# EAGLE design SignalSelector (EAGLE 8.7.0)
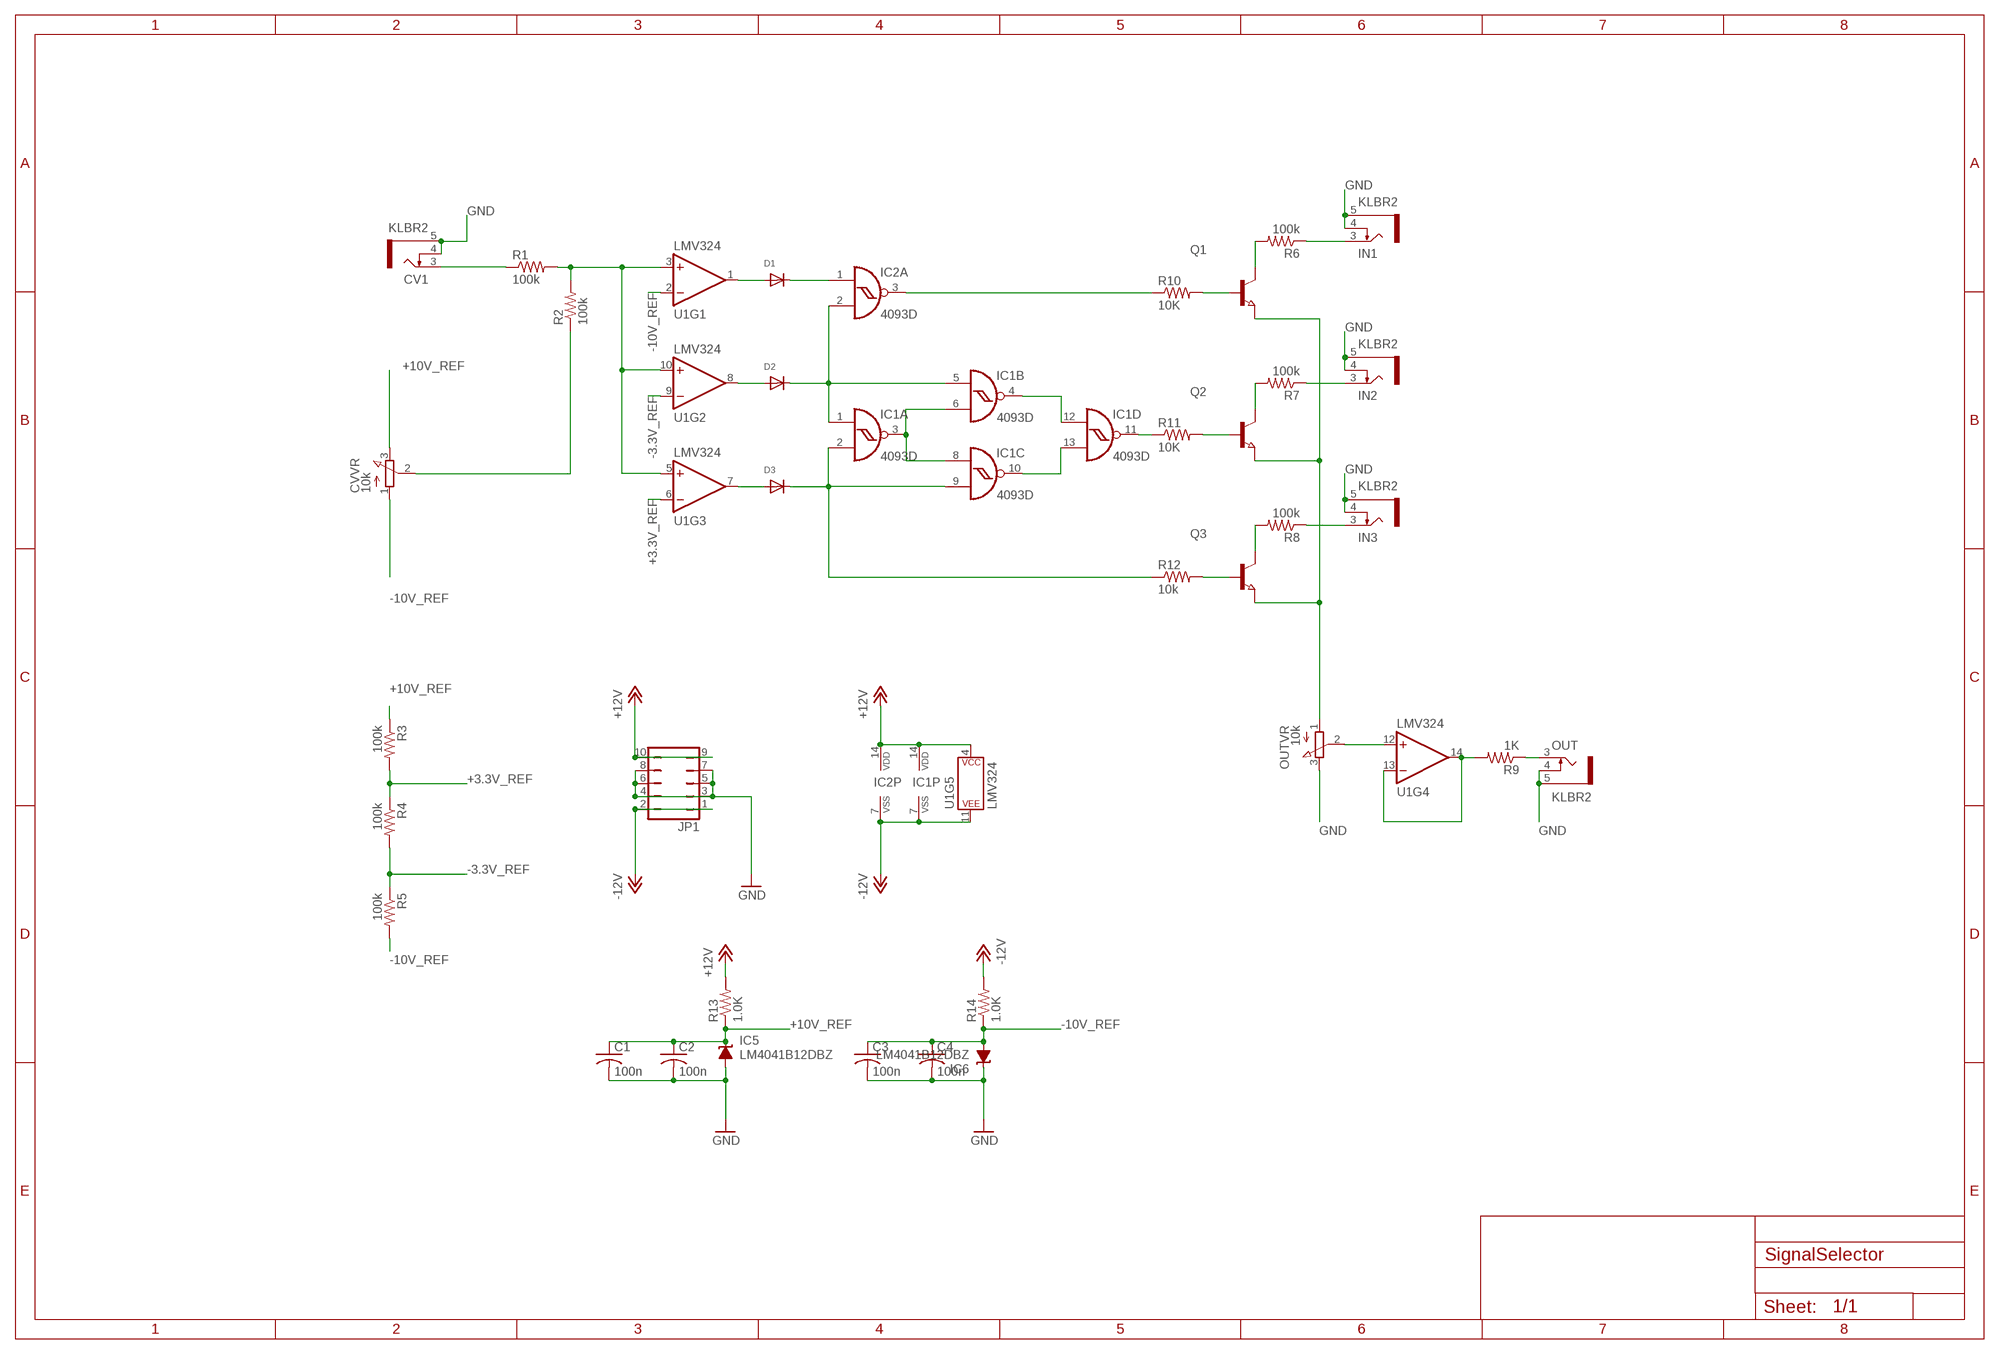
[diagram p0: schematic, sheet 1]

## Parts
C1  100n  C-USC0603  [C0603]
C2  100n  C-USC0603  [C0603]
C3  100n  C-USC0603  [C0603]
C4  100n  C-USC0603  [C0603]
CV1  KLBR2  [KLBR2]
CVVR  10k  3RP/1610N  [3RP/1610N]
D1  DIODE_SOD-123FL  [SOD-123FL]
D2  DIODE_SOD-123FL  [SOD-123FL]
D3  DIODE_SOD-123FL  [SOD-123FL]
IC1  4093D  [SO14]
IC2  4093D  [SO14]
IC5  LM4041B12DBZ  [DBZ_R-PDSO-G3]
IC6  LM4041B12DBZ  [DBZ_R-PDSO-G3]
IN1  KLBR2  [KLBR2]
IN2  KLBR2  [KLBR2]
IN3  KLBR2  [KLBR2]
JP1  JP5Q  [JP5Q]
OUT  KLBR2  [KLBR2]
OUTVR  10k  3RP/1610N  [3RP/1610N]
Q1  NPN-TRANSISTOR_SOT23  [SOT23]
Q2  NPN-TRANSISTOR_SOT23  [SOT23]
Q3  NPN-TRANSISTOR_SOT23  [SOT23]
R1  100k  R-US_R0603  [R0603]
R2  100k  R-US_R0603  [R0603]
R3  100k  R-US_R0603  [R0603]
R4  100k  R-US_R0603  [R0603]
R5  100k  R-US_R0603  [R0603]
R6  100k  R-US_R0603  [R0603]
R7  100k  R-US_R0603  [R0603]
R8  100k  R-US_R0603  [R0603]
R9  1K  R-US_R0603  [R0603]
R10  10K  R-US_R0603  [R0603]
R11  10K  R-US_R0603  [R0603]
R12  10k  R-US_R0603  [R0603]
R13  1.0K  R-US_R0603  [R0603]
R14  1.0K  R-US_R0603  [R0603]
U1  LMV324  [SO14]

## Nets
+3.3V_REF: R3.2 R4.1 U1.6(-IN)
+10V_REF: C1.1 C2.1 CVVR.3(E) IC5.1(C) R3.1 R13.1
+12V: IC1.14(P:VDD) IC2.14(P:VDD) JP1.9 JP1.10 R13.2 U1.4(P$V+)
-3.3V_REF: R4.2 R5.1 U1.9(-IN)
-10V_REF: C3.1 C4.1 CVVR.1(A) IC6.2(A) R5.2 R14.1 U1.2(-IN)
-12V: IC1.7(P:VSS) IC2.7(P:VSS) JP1.1 JP1.2 R14.2 U1.11(P$V-)
GND: C1.2 C2.2 C3.2 C4.2 CV1.4 CV1.5 IC5.2(A) IC6.1(C) IN1.4 IN1.5 IN2.4 IN2.5 IN3.4 IN3.5 JP1.3 JP1.4 JP1.5 JP1.6 JP1.7 JP1.8 OUT.4 OUT.5 OUTVR.3(E)
N$1: CV1.3 R1.1
N$2: R1.2 R2.2 U1.3(+IN) U1.5(+IN) U1.10(+IN)
N$3: D1.A U1.1(OUT)
N$4: CVVR.2(S) R2.1
N$5: D2.A U1.8(OUT)
N$6: D3.A U1.7(OUT)
N$7: D1.C IC2.1(A:I0)
N$8: D2.C IC1.1(A:I0) IC1.5(B:I0) IC2.2(A:I1)
N$9: D3.C IC1.2(A:I1) IC1.9(C:I1) R12.1
N$10: IC1.3(A:O) IC1.6(B:I1) IC1.8(C:I0)
N$11: IC1.4(B:O) IC1.12(D:I0)
N$12: IC1.10(C:O) IC1.13(D:I1)
N$13: IC2.3(A:O) R10.1
N$14: Q1.1(B) R10.2
N$15: IC1.11(D:O) R11.1
N$16: Q2.1(B) R11.2
N$17: Q3.1(B) R12.2
N$18: OUTVR.1(A) Q1.2(E) Q2.2(E) Q3.2(E)
N$19: OUTVR.2(S) U1.12(+IN)
N$20: R9.2 U1.13(-IN) U1.14(OUT)
N$21: Q1.3(C) R6.2
N$22: IN1.3 R6.1
N$23: IN2.3 R7.1
N$24: Q2.3(C) R7.2
N$25: Q3.3(C) R8.2
N$26: IN3.3 R8.1
N$27: OUT.3 R9.1
Unconnected: IC2.4(B:O) IC2.5(B:I0) IC2.6(B:I1) IC2.8(C:I0) IC2.9(C:I1) IC2.10(C:O) IC2.11(D:O) IC2.12(D:I0) IC2.13(D:I1)

## Library data of the parts
C1-C4 = adafruit:C-US: CAPACITOR, American symbol
CV1 IN1-IN3 OUT = con-lumberg:KLBR?: Jack connectors according to JISC 6560, 2.5mm / 3.5 mm Klinkensteckverbinder nach JISC 6560, 2.5mm / 3,5 mm Source: http://www.lumberg.com/Produkte/PDFs/KLBR2.pdf www.lumberg.com/Produkte/PDFs/KLBR1.pdf; OC_FARNELL: unknown; OC_NEWARK: unknown
CVVR OUTVR = pot:3RP/1610N: 16mm Potentiometer one level Source: http://www.alphapotentiometers.net/html/16mm_pot_2.html
D1-D3 = adafruit:DIODE: Diode SMADIODE - SMA Surface Mount Package 20V 1A Schottky Diode Digikey: 641-1014-6-ND DO-1N4148 - Through Hole Small Current Diode SOD-123 20V 1 A (.5mV Vf) Schottky Diode - Digikey: MBRX120TPMSCT-ND SOD-323 10V 570mA (.38mV Vf, 3ns) Schottky Diode - Digikey: ZLLS410CT-ND SOD-523 30V 30mA Schottky Diode (RB751S-40TE61) - Digikey: RB751S-40TE61CT-ND SOT23-R/W - SOT23 Package (R = Solder Paste/Reflow Ovens, W = Hand-Soldering) BAT54Film 40V 300mA - Digikey: 497-7162-1-ND
IC1 IC2 = 40xx:4093: Quad 2-input NAND schmitt trigger
IC5 IC6 = texas:LM4041: PRECISION MICROPOWER SHUNT VOLTAGE REFERENCE Source: http://focus.ti.com/lit/ds/slcs146e/slcs146e.pdf; MPN: LM4041B12IDBZR; OC_FARNELL: 1575212; OC_NEWARK: 58K5882
JP1 = jumper:JP5Q: JUMPER
Q1-Q3 = semicon-smd-ipc:NPN-TRANSISTOR_: NPN TRANSISTOR
R1-R14 = adafruit:R-US_: RESISTOR, American symbol
U1 = SparkFun-IC-Amplifiers:LMV324: IC LMV324 Quad Op Amp Jellybean quad op-amp Datasheet <http://cdn.sparkfun.com/datasheets/Sensors/Sound/LMV324.pdf> SparkFun Products SparkFun Sensor Kit <https://www.sparkfun.com/products/13754> (DEV-13754) SparkFun Inventor's Kit for Arduino 101 <https://www.sparkfun.com/products/13844> (KIT-13844) SparkFun Sound Detector <https://www.sparkfun.com/products/12642> (SEN-12642); PROD_ID: IC-08227

## Board
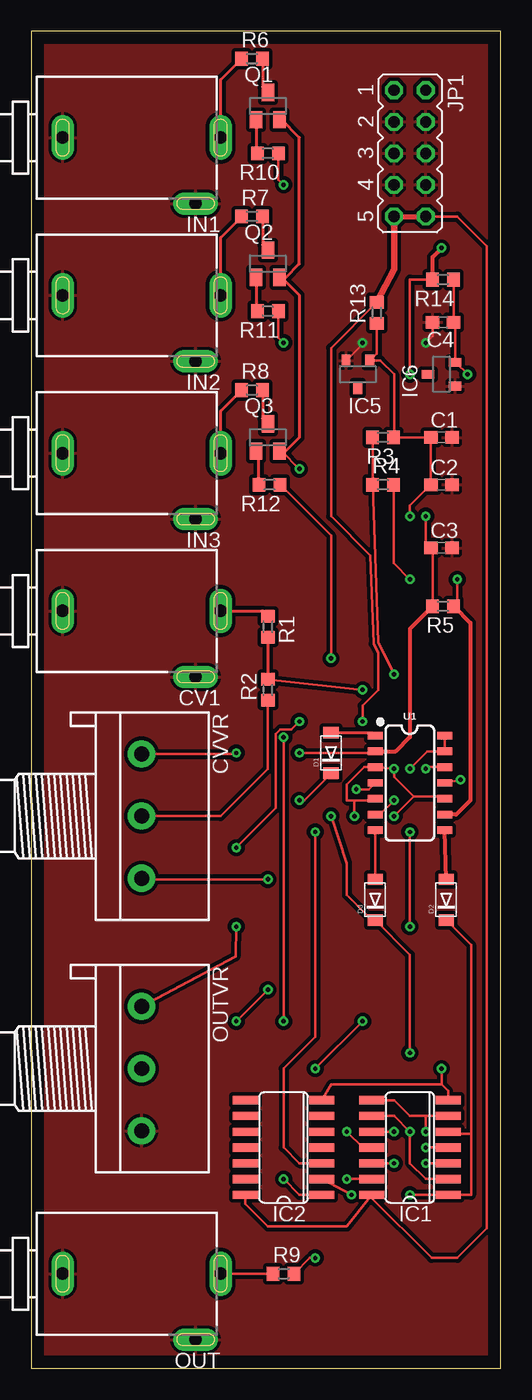
[diagram p1: board, top side]
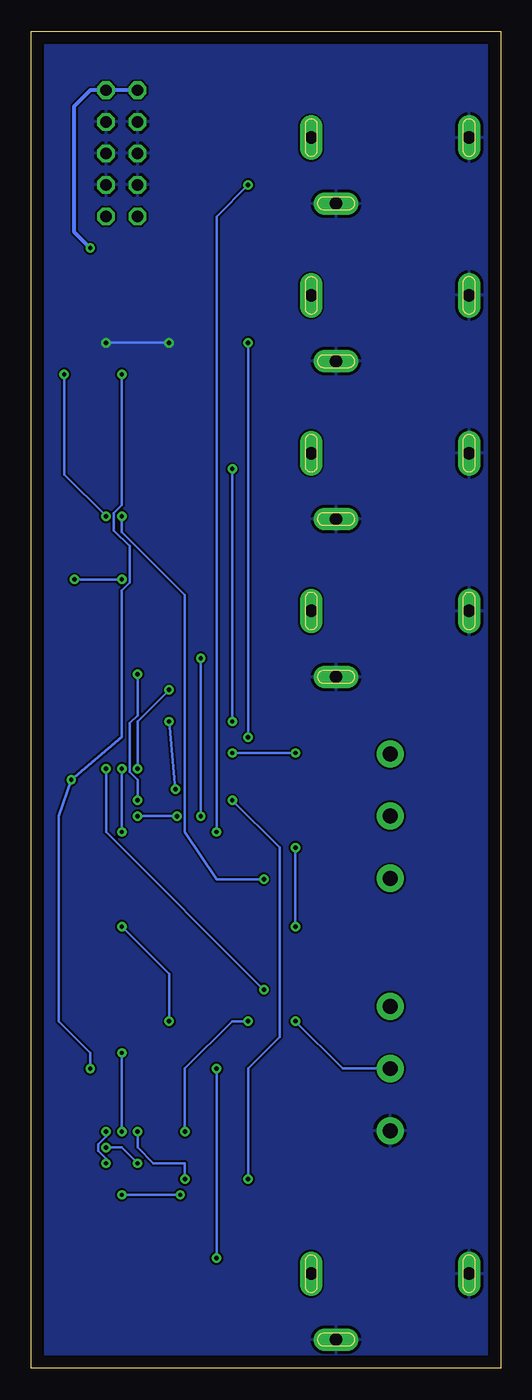
[diagram p2: board, bottom side, seen from below]

Size 37.78 x 107.63 mm. Coordinates in mm from the lower left corner, seen from the top.
Outline: 0,0 37.78,0 37.78,107.63 0,107.63 0,0
Copper layers (1*16): Top 0.035mm / dielectric 1.5mm / Bottom 0.035mm
Design rules "default": minimum track width 6mil, minimum drill 0.35mm, track to track 6mil, track to pad 6mil, pad to pad 6mil, via to via 6mil, smd to smd 6mil, copper to edge 40mil, drill to drill 6mil, minimum pad ring 10mil, minimum via ring 8mil, stop-mask expansion 4mil, vias tented up to drill 0mil, thermal gap 10mil

### Footprints (pad centres in the part's own frame; a part is rotated, then mirrored left to right if it is on the bottom)
C0603 = smd 1.1 x 1: 1 -0.85,0; 2 0.85,0
KLBR2 = drill 1 pad 1.8 long: 3 0,-6.35; 4 -5.3,-4.35; 5 0,6.35
3RP/1610N = drill 1.2 pad 2.184: 1 -5,0; 2 0,0; 3 5,0
SOD-123FL = smd 0.91 x 1.22: A 1.637,0; C -1.637,0
SO14 = smd 0.66 x 2.032: 1 -3.81,-3.073; 2 -2.54,-3.073; 3 -1.27,-3.073; 4 0,-3.073; 5 1.27,-3.073; 6 2.54,-3.073; 7 3.81,-3.073; 8 3.81,3.073; 9 2.54,3.073; 10 1.27,3.073; 11 0,3.073; 12 -1.27,3.073; 13 -2.54,3.073; 14 -3.81,3.073
DBZ_R-PDSO-G3 = smd 0.7 x 1: 1 -0.95,-1.1; 2 0.95,-1.1; 3 0,1.1
JP5Q = drill 0.914 octagon: 1 -5.08,-1.27; 2 -5.08,1.27; 3 -2.54,-1.27; 4 -2.54,1.27; 5 0,-1.27; 6 0,1.27; 7 2.54,-1.27; 8 2.54,1.27; 9 5.08,-1.27; 10 5.08,1.27
SOT23 = smd 1 x 1.4: 1 -0.95,-1.1; 2 0.95,-1.1; 3 0,1.1
R0603 = smd 1 x 1.1: 1 -0.85,0; 2 0.85,0
SO14' = smd 0.6 x 1.2: 1 -3.175,-2.8; 2 -1.905,-2.8; 3 -0.635,-2.8; 4 0.635,-2.8; 5 1.905,-2.8; 6 3.175,-2.8; 7 4.445,-2.8; 8 4.445,2.8; 9 3.175,2.8; 10 1.905,2.8; 11 0.635,2.8; 12 -0.635,2.8; 13 -1.905,2.8; 14 -3.175,2.8

### Placement (x,y rotation side)
C1  33.02,74.93 0 top
C2  33.02,71.12 0 top
C3  33.02,66.04 0 top
C4  33.15,84.2 180 top
CV1  8.89,60.96 90 top
CVVR  8.89,44.45 270 top
D1  24.13,49.53 90 top
D2  33.4,37.72 90 top
D3  27.69,37.72 90 top
IC1  30.48,17.78 90 top
IC2  20.32,17.78 90 top
IC5  26.29,80.01 180 top
IC6  33.02,80.01 90 top
IN1  8.89,99.06 90 top
IN2  8.89,86.36 90 top
IN3  8.89,73.66 90 top
JP1  30.48,97.79 270 top
OUT  8.89,7.62 90 top
OUTVR  8.89,24.13 270 top
Q1  19.05,101.6 0 top
Q2  19.05,88.9 0 top
Q3  19.05,74.93 0 top
R1  19.05,59.69 270 top
R2  19.05,54.61 90 top
R3  28.32,74.93 180 top
R4  28.32,71.12 0 top
R5  33.15,61.34 180 top
R6  17.78,105.41 0 top
R7  17.78,92.71 0 top
R8  17.78,78.74 0 top
R9  20.32,7.62 0 top
R10  19.05,97.79 180 top
R11  19.05,85.09 180 top
R12  19.18,71.12 180 top
R13  27.81,84.96 90 top
R14  33.15,87.63 180 top
U1  LMV324  [SO14']  30.48,47.75 270 top

### Tracks (layer width: path | path; a pad name or v marks a point on that pad's centre or on a via)
+3.3V_REF  (via drill 0.35)
  Top 0.2: R3.2 R4.1 27.94,58.42 v29.21,55.88 | v29.21,45.72 28.07,44.58 U1.6
  Bottom 0.2: v29.21,55.88 29.21,52.57 29.84,51.94 29.84,48 29.21,47.37 v29.21,45.72
+10V_REF  (via drill 0.35)
  Top 0.2: R13.1 27.81,81.68 IC5.1 28.11,81.11 29.21,80.01 29.21,74.97 R3.1 C1.1 C2.1 30.48,69.43 v30.48,68.58 | v19.05,39.37 8.97,39.37 CVVR.3
  Bottom 0.2: v30.48,68.58 30.48,67.31 25.4,62.23 25.4,43.18 22.86,39.37 v19.05,39.37
+12V  (via drill 0.35)
  Top 0.2: IC2.14 17.25,13.23 19.05,11.43 25.4,11.43 27.29,13.82 | 27.29,13.82 IC1.14 | R13.2 24.13,82.13 24.13,68.58 27.3,65.41 27.56,58.32 27.94,57.57 27.94,54.61 26.67,53.34 v26.67,52.07 | v26.16,46.61 27.17,46.61 U1.4 | JP1.10 34.29,92.71 36.66,90.34 36.66,11.26 34.29,8.89 32.22,8.89 27.29,13.82
  Top 0.406: JP1.9 JP1.10
  Top 0.508: JP1.9 29.21,88.48 R13.2
  Bottom 0.2: v26.67,52.07 v26.16,46.61
-3.3V_REF  (via drill 0.35)
  Top 0.2: R4.2 29.17,64.81 v30.48,63.5 | v34.29,63.5 34.29,61.63 R5.1
  Top 0.305: R5.1 35.34,60 35.34,45.72 34.2,44.58 U1.9
  Bottom 0.2: v30.48,63.5 v34.29,63.5
-10V_REF  (via drill 0.35)
  Top 0.2: R5.2 32.3,65.91 C3.1 31.75,66.46 v31.75,68.58 | 34.12,84.08 IC6.2 34.17,80.96 v35.12,80.01 | 34.12,84.08 C4.1 | R14.1 C4.1 | C4.1 34.12,84.08 | CVVR.1 16.43,49.45 v16.51,49.53 | v21.59,49.53 27.93,49.53 28.05,49.66
  Top 0.305: R5.2 30.48,59.52 30.48,50.8 29.34,49.66 28.05,49.66 U1.2
  Bottom 0.2: v35.12,80.01 35.12,71.95 v31.75,68.58 | v16.51,49.53 v21.59,49.53
-12V  (via drill 0.35)
  Top 0.2: IC1.7 33.55,22.33 33.02,22.86 | 33.02,22.86 24.13,22.86 IC2.7 | U1.11 v34.54,47.37 | v33.02,24.13 33.02,22.86 | v30.48,80.01 30.48,87.63 R14.2
  Top 0.305: R14.2 32.3,89.45 v33.02,90.17
  Bottom 0.2: v33.02,24.13 33.02,25.4 35.56,27.94 35.56,44.45 v34.54,47.37 30.48,50.8 30.48,62.61 29.85,63.24 29.85,66.18 31.11,67.44 31.11,68.84 30.48,69.47 v30.48,80.01
  Bottom 0.305: v33.02,90.17 34.29,91.44 34.29,101.6 33.02,102.87 JP1.2 JP1.1
GND  (via drill 0.35)
  Top 0.2: C4.2 32.3,83.1 v31.75,82.55 | v26.67,82.55 26.67,82.44 IC5.2
  Bottom 0.2: v31.75,82.55 v26.67,82.55
  pour Top (isolate 0.305): 0,107.95 0,0 38.1,0 38.1,107.95
  pour Bottom: 0,107.95 0,0 38.1,0 38.1,107.95
N$1
  Top 0.254: CV1.3 18.63,60.96 R1.1
N$2  (via drill 0.35)
  Top 0.2: R2.2 v26.67,54.61 | 27.55,45.72 U1.5 arc-90 27.55,45.72 | 30.79,46.03 29.21,47.62 v29.21,48.26 U1.3 26.8,48.39 25.4,46.99 25.4,45.72 26,45.72 | 32.84,46.03 33.15,45.72 U1.10 arc90 33.09,46.03 30.79,46.03 | 30.79,46.03 v29.21,44.45 | v26.03,44.45 26,44.48 26,45.72 | 26,45.72 27.55,45.72
  Top 0.254: R1.2 R2.2
  Bottom 0.2: v26.67,54.61 29.21,52.07 v29.21,48.26 | v29.21,44.45 v26.03,44.45
N$3
  Top 0.254: D1.A 27.44,51.17 U1.1
N$4
  Top 0.2: R2.1 19.05,48.26 15.24,44.45 CVVR.2
N$5
  Top 0.305: D2.A U1.8
N$6
  Top 0.2: D3.A U1.7
N$7  (via drill 0.35)
  Top 0.2: IC2.1 21.59,13.97 v20.32,15.24 | v21.59,45.72 21.96,45.72 D1.C
  Bottom 0.2: v20.32,15.24 20.32,24.13 17.78,26.67 17.78,36.83 | 17.78,36.83 17.78,37.21 | 17.78,36.83 17.78,41.91 v21.59,45.72
N$8  (via drill 0.35)
  Top 0.2: 35.39,18.88 35.39,13.97 IC1.1 v30.48,13.97 | 35.39,18.88 33.72,18.88 IC1.5 | v25.78,13.97 IC2.2 | D2.C 35.39,34.09 35.39,18.88
  Bottom 0.2: v30.48,13.97 v25.78,13.97
N$9  (via drill 0.35)
  Top 0.2: R12.1 24.13,67.02 v24.13,57.15 | v24.13,44.45 25.4,40.64 25.4,38.1 27.42,36.08 D3.C 30.48,33.29 v30.48,25.4 | IC1.9 29.21,20.32 v30.48,19.05 30.48,16.51 31.75,15.24 IC1.2
  Bottom 0.2: v24.13,57.15 v24.13,44.45 | v30.48,25.4 v30.48,19.05
N$10  (via drill 0.35)
  Top 0.2: IC1.8 29.21,21.59 30.48,20.32 31.75,20.32 | 31.75,20.32 IC1.6 | IC1.3 v31.75,16.51 | v31.75,19.05 31.75,20.32 arc-90 31.75,20.32
  Bottom 0.2: v31.75,16.51 31.75,16.89 32.38,17.52 32.38,18.04 31.75,18.67 v31.75,19.05
N$11  (via drill 0.35)
  Top 0.2: IC1.12 v29.21,16.51 | v31.75,17.78 IC1.4
  Bottom 0.2: v29.21,16.51 30.48,17.78 v31.75,17.78
N$12  (via drill 0.35)
  Top 0.2: IC1.10 v29.21,19.05 | v25.4,15.24 IC1.13
  Bottom 0.2: v29.21,19.05 29.21,17.78 27.94,16.51 25.4,16.51 v25.4,15.24
N$13  (via drill 0.35)
  Top 0.2: R10.1 19.9,95.67 v20.32,95.25 | v22.86,43.18 22.86,26.67 20.32,24.13 20.32,17.78 21.59,16.51 IC2.3
  Bottom 0.2: v20.32,95.25 22.86,92.71 v22.86,43.18
N$14
  Top 0.254: Q1.1 18.1,97.89 R10.2
N$15  (via drill 0.35)
  Top 0.2: R11.1 19.9,82.97 v20.32,82.55 | v20.32,50.8 v20.32,27.94 | v25.4,19.05 26.67,17.78 IC1.11
  Bottom 0.2: v20.32,82.55 v20.32,50.8 | v20.32,27.94 21.59,27.94 25.4,24.13 v25.4,19.05
N$16
  Top 0.254: Q2.1 18.1,85.19 R11.2
N$17
  Top 0.254: R12.2 18.33,73.6 Q3.1
N$18  (via drill 0.35)
  Top 0.2: Q3.2 20.15,73.83 v21.59,72.39 | v16.51,41.91 19.69,45.09 19.69,51.06 20.06,51.43 20.95,51.43 v21.59,52.07 | v16.51,35.56 16.46,33.15 OUTVR.1
  Top 0.254: Q1.2 20.15,100.5 21.59,99.06 21.59,88.9 20.49,87.8 Q2.2 20.15,87.8 21.59,86.36 21.59,74.93 20.32,73.66 20.17,73.66 Q3.2
  Bottom 0.2: v21.59,72.39 v21.59,52.07 | v16.51,41.91 v16.51,35.56
N$19  (via drill 0.35)
  Top 0.2: U1.12 31.88,48.39 v31.75,48.26 | v16.51,27.94 v19.05,30.48
  Bottom 0.2: OUTVR.2 12.7,24.13 v16.51,27.94 | v19.05,30.48 31.75,43.18 v31.75,48.26
N$20  (via drill 0.35)
  Top 0.2: R9.2 22.44,8.89 v22.86,8.89 | v22.86,24.13 v26.67,27.94 | v30.48,48.26 31.88,49.66 U1.13 U1.14 | v30.48,43.18 v30.48,35.56
  Bottom 0.2: v22.86,8.89 v22.86,24.13 | v30.48,48.26 v30.48,43.18 | v26.67,27.94 26.67,31.75 v30.48,35.56
N$21
  Top 0.254: R6.2 18.63,103.12 Q1.3
N$22
  Top 0.254: IN1.3 15.24,103.72 R6.1
N$23
  Top 0.254: IN2.3 15.24,91.02 R7.1
N$24
  Top 0.254: R7.2 18.63,90.42 Q2.3
N$25
  Top 0.254: R8.2 18.63,76.45 Q3.3
N$26
  Top 0.254: IN3.3 15.24,77.05 R8.1
N$27
  Top 0.2: OUT.3 R9.1